# Altium schematic sheet Main_9.SchDoc
size 170 x 170 mm; SheetNumber: 12; SheetTotal: 12
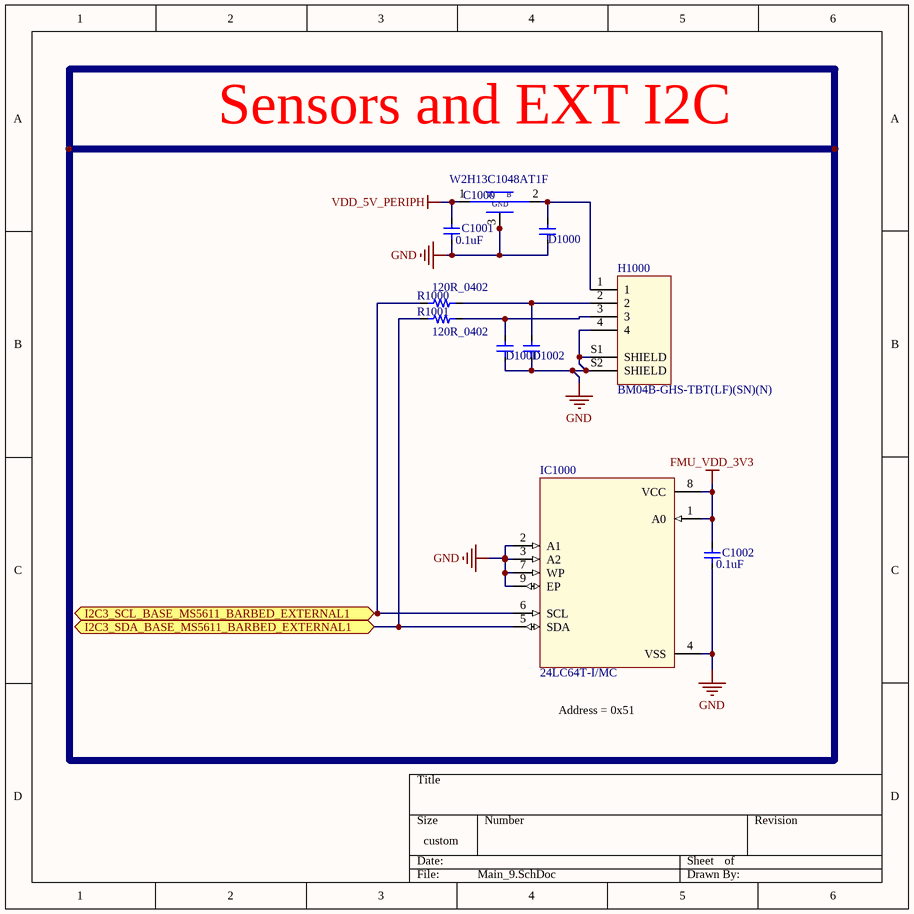
[diagram p0: Main_9.SchDoc]

## Parts
C1000  W2H13C1048AT1F  [W2H13C1048AT1F]
C1001  0.1uF  [C0603]
C1002  0.1uF  [C0603]
D1000  PESD0402-140  [PESD0402-140]  (value not drawn)
D1001  PESD0402-140  [PESD0402-140]  (value not drawn)
D1002  PESD0402-140  [PESD0402-140]  (value not drawn)
H1000  BM04B-GHS-TBT(LF)(SN)(N)  [BM04B-GHS-TBT(LF)(SN)(N)]
IC1000  24LC64T-I/MC  [8DFN]
R1000  120R_0402  [R0402]
R1001  120R_0402  [R0402]

## Ports
I2C3_SCL_BASE_MS5611_BARBED_EXTERNAL1 (bidir), I2C3_SDA_BASE_MS5611_BARBED_EXTERNAL1 (bidir)

## Nets
FMU_VDD_3V3: C1002.2 IC1000.1(A0) IC1000.8(VCC)
GND: C1000.3 C1000.4 C1001.1 C1002.1 D1000.1 D1001.1 D1002.1 H1000.4 H1000.S1(SHIELD) H1000.S2(SHIELD) IC1000.2(A1) IC1000.3(A2) IC1000.4(VSS) IC1000.7(WP) IC1000.9(EP)
VDD_5V_PERIPH: C1000.1 C1001.2
I2C3_SCL_BASE_MS5611_BARBED_EXTERNAL1: IC1000.6(SCL) R1000.1 ; port I2C3_SCL_BASE_MS5611_BARBED_EXTERNAL1
I2C3_SDA_BASE_MS5611_BARBED_EXTERNAL1: IC1000.5(SDA) R1001.1 ; port I2C3_SDA_BASE_MS5611_BARBED_EXTERNAL1
NetC1000_2: C1000.2 D1000.2 H1000.1
NetD1001_2: D1001.2 H1000.3 R1001.2
NetD1002_2: D1002.2 H1000.2 R1000.2

## Notes on the sheet
- Sensors and EXT I2C
- (near IC1000) Address = 0x51
- (in symbol W2H13C1048AT1F) A; B; GND

## Library data of the parts
C1000 = W2H13C1048AT1F: Feed Through Capacitors 25V 0.1uF X7R
C1001 C1002 = CC0603KRX7R8BB104: CAP CER 0.1UF 25V X7R 0603
D1000-D1002 = PESD0402-140: 40V Clamp - Ipp Tvs Diode Surface Mount 0402
H1000 = BM04B-GHS-TBT(LF)(SN)(N): Connector Header Surface Mount 4 position 0.049" (1.25mm)
IC1000 = 24LC64T-I/MC: IC EEPROM 64KBIT I2C 400KHZ 8DFN
R1000 R1001 = RC0402FR-07120RL: 120 Ohms ±1% 0.063W, 1/16W Chip Resistor 0402 (1005 Metric) Moisture Resistant Thick Film